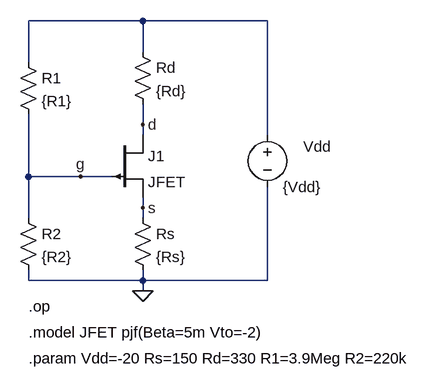
[diagram p0: schematic FET05op.asc]
FET05op.asc, the LTspice schematic file:
Version 4
SHEET 1 1608 1076
WIRE 192 -128 16 -128
WIRE 384 -128 192 -128
WIRE 192 -80 192 -128
WIRE 16 -64 16 -128
WIRE 192 32 192 0
WIRE 192 48 192 32
WIRE 384 48 384 -128
WIRE 16 112 16 16
WIRE 96 112 16 112
WIRE 144 112 96 112
WIRE 192 160 192 144
WIRE 16 176 16 112
WIRE 192 176 192 160
WIRE 16 272 16 256
WIRE 192 272 192 256
WIRE 192 272 16 272
WIRE 384 272 384 128
WIRE 384 272 192 272
WIRE 192 288 192 272
FLAG 192 288 0
FLAG 96 112 g
FLAG 192 32 d
FLAG 192 160 s
SYMBOL voltage 384 32 R0
WINDOW 0 55 34 Left 2
WINDOW 123 0 0 Left 0
WINDOW 39 0 0 Left 0
SYMATTR InstName Vdd
SYMATTR Value {Vdd}
SYMBOL res 176 -96 R0
SYMATTR InstName Rd
SYMATTR Value {Rd}
SYMBOL res 176 160 R0
SYMATTR InstName Rs
SYMATTR Value {Rs}
SYMBOL res 0 160 R0
SYMATTR InstName R2
SYMATTR Value {R2}
SYMBOL pjf 144 48 R0
SYMATTR InstName J1
SYMATTR Value JFET
SYMBOL res 0 -80 R0
SYMATTR InstName R1
SYMATTR Value {R1}
TEXT 16 312 Left 2 !.op
TEXT 16 352 Left 2 !.model JFET pjf(Beta=5m Vto=-2)
TEXT 16 392 Left 2 !.param Vdd=-20 Rs=150 Rd=330 R1=3.9Meg R2=220k

The netlist it stands for:
* FET05op.asc
Vdd N001 0 {Vdd}
Rd N001 d {Rd}
Rs s 0 {Rs}
R2 g 0 {R2}
J1 d g s JFET
R1 N001 g {R1}
.model NJF NJF
.model PJF PJF
.lib standard.jft
.op
.model JFET pjf(Beta=5m Vto=-2)
.param Vdd=-20 Rs=150 Rd=330 R1=3.9Meg R2=220k
.backanno
.end